# Altium schematic sheet 1_P1.schdoc
size 431 x 309 mm; Symbol: sheet-symbol_a4; Device: Sheet-Symbol_A4; Company: 嘉立创EDA; Version: V1.0; Page Size: A4; @Project Name: STM32F407保险方案; @Page Count: 2; @Update Date: 2024-10-13; @Create Date: 2024-10-12; @Schematic Name: Schematic1_2; @Page No: 1; @Page Name: P1; @Board Name: Board1_v1_修改; @Create Time: 12:06:10; @Update Time: 12:06:11; Width: 1655; Height: 1170; Region Start: 1; X Region Count: 6; Y Region Count: 4; Blade Width: 10; Title Block Position: 3
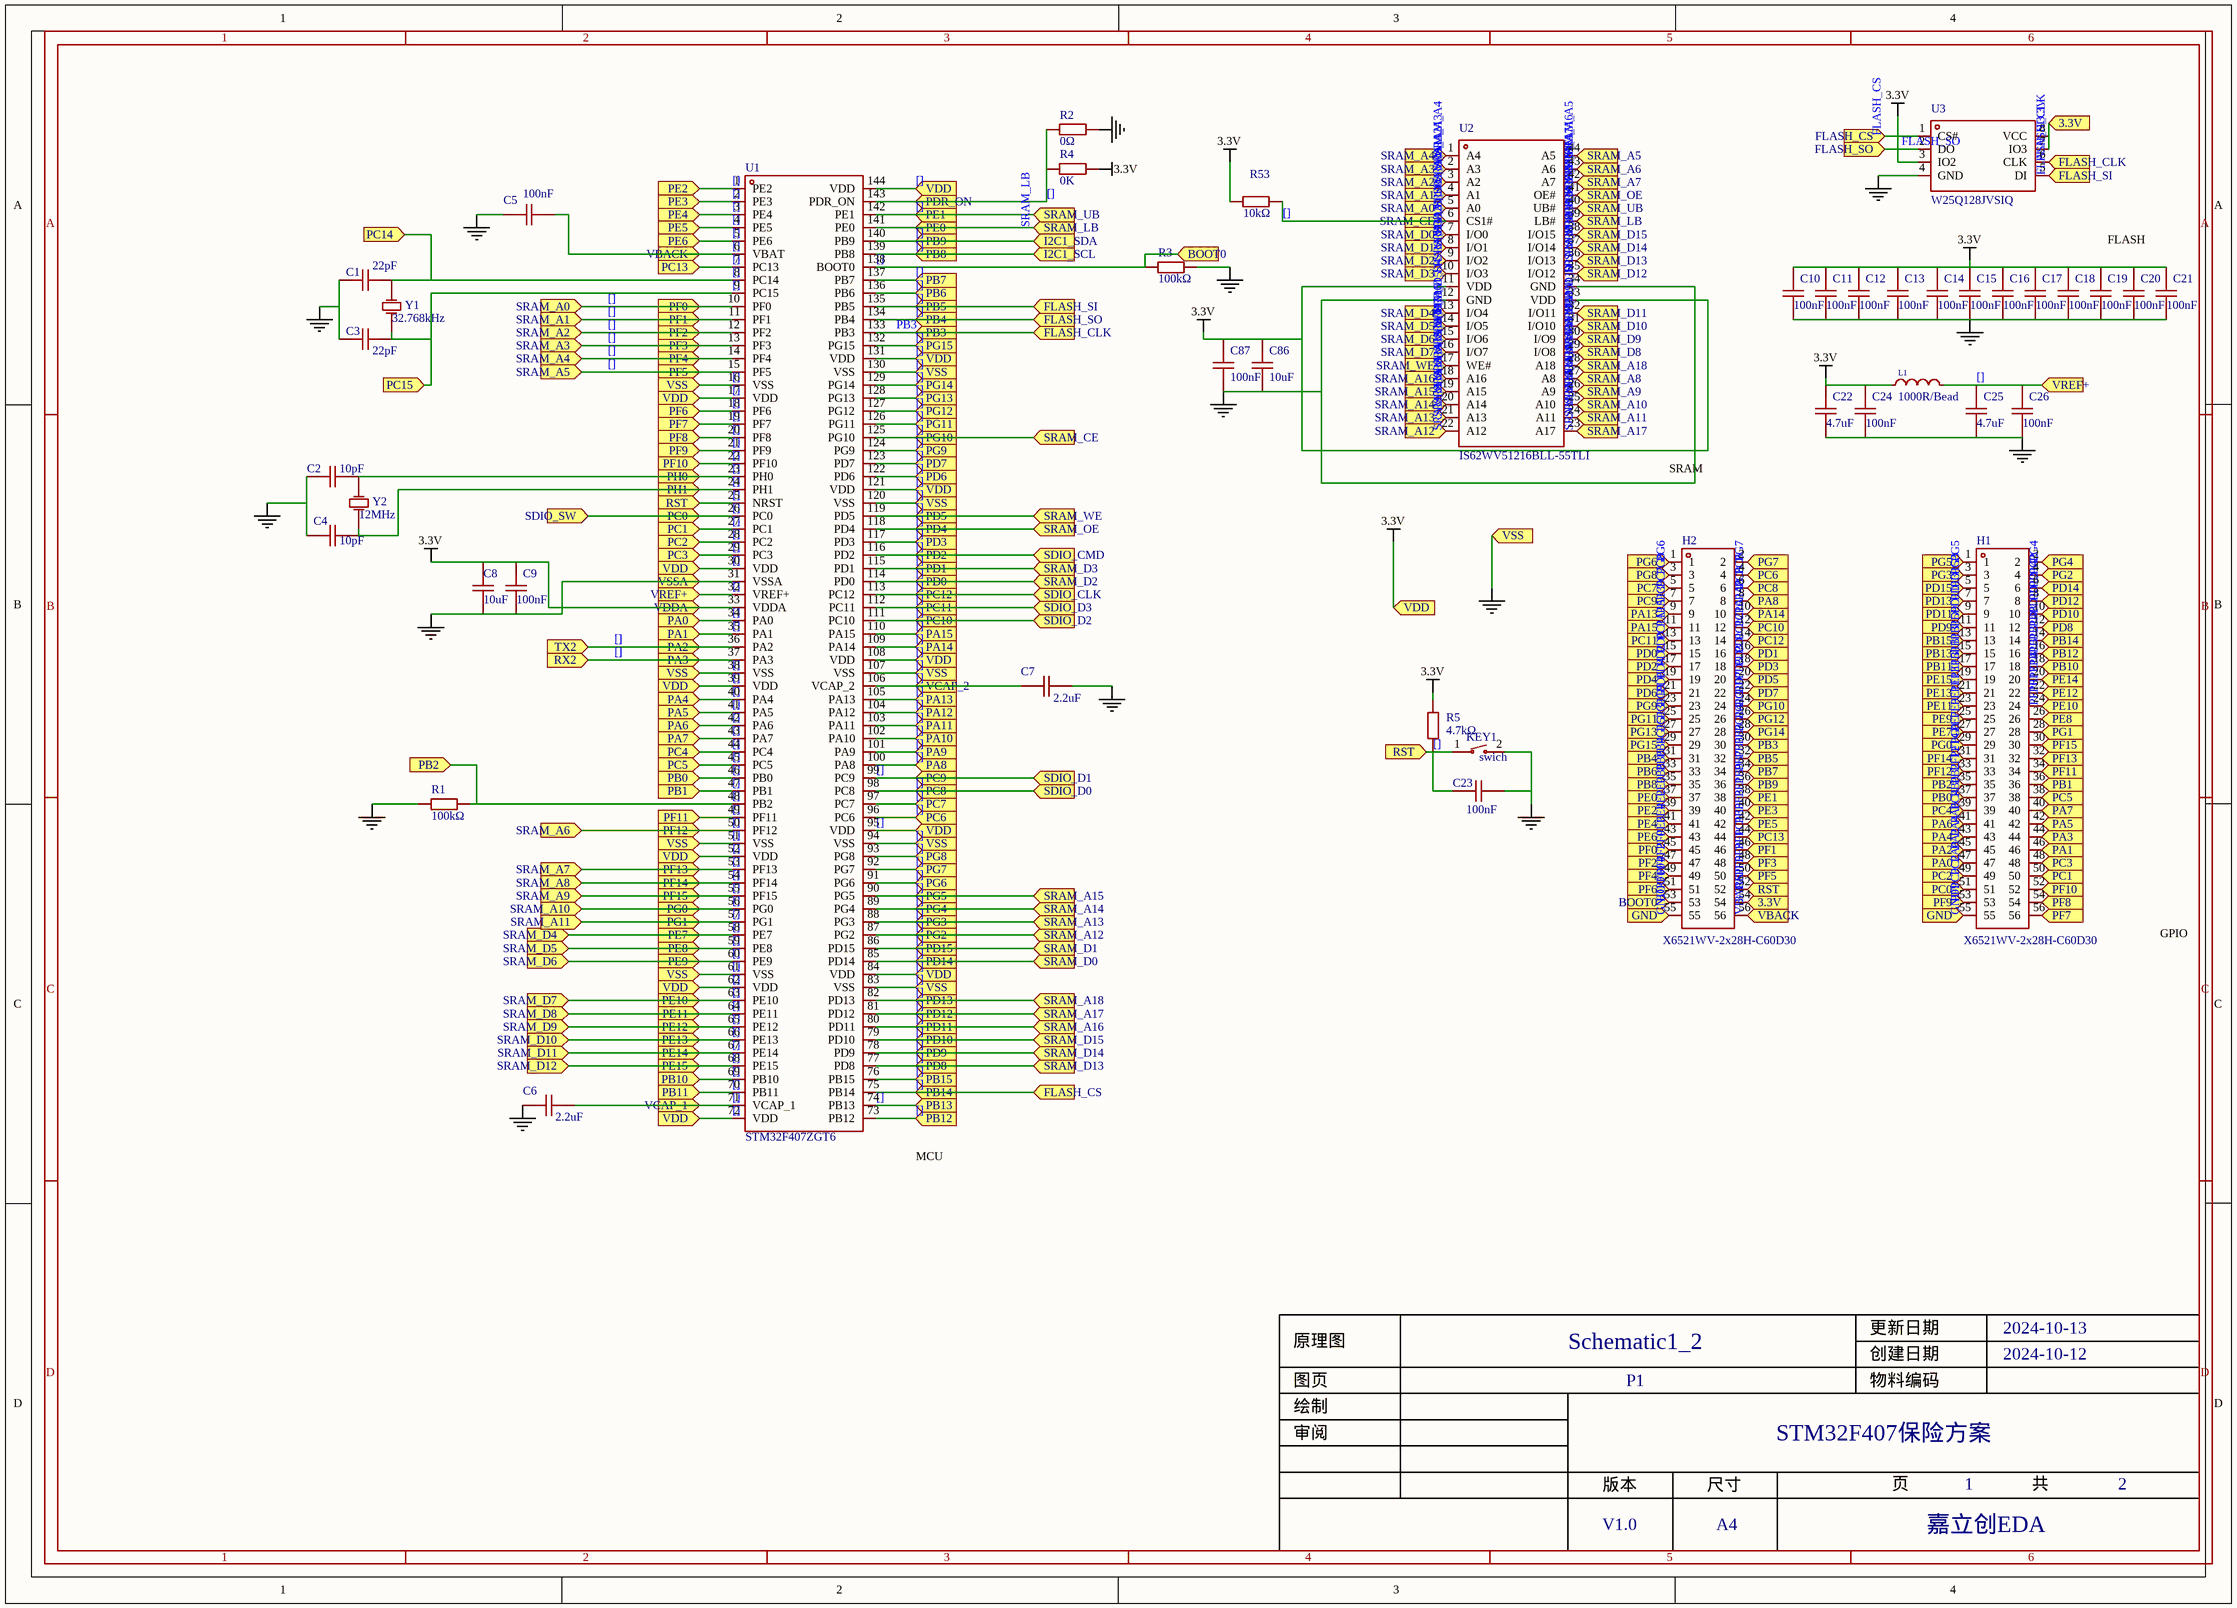
[diagram p0: 1_P1.schdoc]

## Parts
C1  22pF  [C0805]  (value not drawn)
C2  10pF  [C0805]  (value not drawn)
C3  22pF  [C0805]  (value not drawn)
C4  10pF  [C0805]  (value not drawn)
C5  100nF  [C0805]  (value not drawn)
C6  2.2uF  [C0805]  (value not drawn)
C7  2.2uF  [C0805]  (value not drawn)
C8  10uF  [C0805]  (value not drawn)
C9  100nF  [C0805]  (value not drawn)
C10  100nF  [C0805]  (value not drawn)
C11  100nF  [C0805]  (value not drawn)
C12  100nF  [C0805]  (value not drawn)
C13  100nF  [C0805]  (value not drawn)
C14  100nF  [C0805]  (value not drawn)
C15  100nF  [C0805]  (value not drawn)
C16  100nF  [C0805]  (value not drawn)
C17  100nF  [C0805]  (value not drawn)
C18  100nF  [C0805]  (value not drawn)
C19  100nF  [C0805]  (value not drawn)
C20  100nF  [C0805]  (value not drawn)
C21  100nF  [C0805]  (value not drawn)
C22  4.7uF  [C0805]  (value not drawn)
C23  100nF  [C0805]  (value not drawn)
C24  100nF  [C0805]  (value not drawn)
C25  4.7uF  [C0805]  (value not drawn)
C26  100nF  [C0805]  (value not drawn)
C86  10uF  [C0805]  (value not drawn)
C87  100nF  [C0805]  (value not drawn)
H1  X6521WV-2x28H-C60D30  [HDR-TH_56P-2.54-V-M-R2-C28-S2.54]  (value not drawn)
H2  X6521WV-2x28H-C60D30  [HDR-TH_56P-2.54-V-M-R2-C28-S2.54]  (value not drawn)
KEY1  swich  [KEY-SMD_L6.0-W3.6-LS8.0]  (value not drawn)
L1  1000R/Bead  [L0805]  (value not drawn)
R1  100kΩ  [R0805]  (value not drawn)
R2  0Ω  [R0805]  (value not drawn)
R3  100kΩ  [R0805]  (value not drawn)
R4  0K  [R0805]  (value not drawn)
R5  4.7kΩ  [R0805]  (value not drawn)
R53  10kΩ  [R0805]  (value not drawn)
U1  STM32F407ZGT6  [LQFP-144_L20.0-W20.0-P0.50-LS22.0-BL]  (value not drawn)
U2  IS62WV51216BLL-55TLI  [TSOP-44_L18.4-W10.2-P0.80-LS11.8-BL]  (value not drawn)
U3  W25Q128JVSIQ  [SOIC-8_L5.3-W5.3-P1.27-LS8.0-BL]  (value not drawn)
Y1  32.768kHz  [OSC-TH_BD3.1-P0.8-D0.3]  (value not drawn)
Y2  12MHz  [HC-49US_L11.5-W4.5-P4.88]  (value not drawn)

## Ports
3.3V (in), BOOT0 (in), FLASH_CLK (in), FLASH_CS (in), FLASH_SI (in), FLASH_SO (in), GND (in), I2C1_SCL (in), I2C1_SDA (in), PA0 (in), PA1 (in), PA2 (in), PA3 (in), PA4 (in), PA5 (in), PA6 (in), PA7 (in), PA8 (in), PA9 (in), PA10 (in), PA11 (in), PA12 (in), PA13 (in), PA14 (in), PA15 (in), PB0 (in), PB1 (in), PB2 (in), PB3 (in), PB4 (in), PB5 (in), PB6 (in), PB7 (in), PB8 (in), PB9 (in), PB10 (in), PB11 (in), PB12 (in), PB13 (in), PB14 (in), PB15 (in), PC0 (in), PC1 (in), PC2 (in), PC3 (in), PC4 (in), PC5 (in), PC6 (in), PC7 (in), PC8 (in), PC9 (in), PC10 (in), PC11 (in), PC12 (in), PC13 (in), PC14 (in), PC15 (in), PD0 (in), PD1 (in), PD2 (in), PD3 (in), PD4 (in), PD5 (in), PD6 (in), PD7 (in), PD8 (in), PD9 (in), PD10 (in), PD11 (in), PD12 (in), PD13 (in), PD14 (in), PD15 (in), PDR_ON (in), PE0 (in), PE1 (in), PE2 (in), PE3 (in), PE4 (in), PE5 (in), PE6 (in), PE7 (in), PE8 (in), PE9 (in), PE10 (in), PE11 (in), PE12 (in), PE13 (in), PE14 (in), PE15 (in), PF0 (in), PF1 (in), PF2 (in), PF3 (in), PF4 (in), PF5 (in), PF6 (in), PF7 (in), PF8 (in), PF9 (in), PF10 (in), PF11 (in), PF12 (in), PF13 (in), PF14 (in), PF15 (in), PG0 (in), PG1 (in), PG2 (in), PG3 (in), PG4 (in), PG5 (in), PG6 (in), PG7 (in), PG8 (in), PG9 (in), PG10 (in), PG11 (in), PG12 (in), PG13 (in), PG14 (in), PG15 (in), PH0 (in), PH1 (in), RST (in), RX2 (in), SDIO_CLK (in), SDIO_CMD (in), SDIO_D0 (in), SDIO_D1 (in), SDIO_D2 (in), SDIO_D3 (in), SDIO_SW (in), SRAM_A0 (in), SRAM_A1 (in), SRAM_A2 (in), SRAM_A3 (in), SRAM_A4 (in), SRAM_A5 (in), SRAM_A6 (in), SRAM_A7 (in), SRAM_A8 (in), SRAM_A9 (in), SRAM_A10 (in), SRAM_A11 (in), SRAM_A12 (in), SRAM_A13 (in), SRAM_A14 (in), SRAM_A15 (in), SRAM_A16 (in), SRAM_A17 (in), SRAM_A18 (in), SRAM_CE (in), SRAM_D0 (in), SRAM_D1 (in), SRAM_D2 (in), SRAM_D3 (in), SRAM_D4 (in), SRAM_D5 (in), SRAM_D6 (in), SRAM_D7 (in), SRAM_D8 (in), SRAM_D9 (in), SRAM_D10 (in), SRAM_D11 (in), SRAM_D12 (in), SRAM_D13 (in), SRAM_D14 (in), SRAM_D15 (in), SRAM_LB (in), SRAM_OE (in), SRAM_UB (in), SRAM_WE (in), TX2 (in), VBACK (in), VCAP_1 (in), VCAP_2 (in), VDD (in), VDDA (in), VREF+ (in), VSS (in), VSSA (in)

## Nets
3.3V: C1.2 C2.2 C3.2 C4.2 C5.1 C6.1 C7.2 C8.1 C9.1 C10.2 C11.2 C12.2 C13.2 C14.2 C15.2 C16.2 C17.2 C18.2 C19.2 C20.2 C21.2 C22.2 C23.2 C24.2 C25.2 C26.2 C86.1 C87.1 H1.1 H1.2 H1.3 H1.4 H1.5 H1.6 H1.7 H1.8 H1.9 H1.10 H1.11 H1.12 H1.13 H1.14 H1.15 H1.16 H1.17 H1.18 H1.19 H1.20 H1.21 H1.22 H1.23 H1.24 H1.25 H1.26 H1.27 H1.28 H1.29 H1.30 H1.31 H1.32 H1.33 H1.34 H1.35 H1.36 H1.37 H1.38 H1.39 H1.40 H1.41 H1.42 H1.43 H1.44 H1.45 H1.46 H1.47 H1.48 H1.49 H1.50 H1.51 H1.52 H1.53 H1.54 H1.56 H2.1 H2.2 H2.3 H2.4 H2.5 H2.6 H2.7 H2.8 H2.9 H2.10 H2.11 H2.12 H2.13 H2.14 H2.15 H2.16 H2.17 H2.18 H2.19 H2.20 H2.21 H2.22 H2.23 H2.24 H2.25 H2.26 H2.27 H2.28 H2.29 H2.31 H2.32 H2.33 H2.34 H2.35 H2.36 H2.38 H2.39 H2.40 H2.41 H2.42 H2.43 H2.44 H2.45 H2.46 H2.47 H2.48 H2.49 H2.50 H2.51 H2.52 H2.53 H2.54 H2.56 KEY1.1 L1.1 L1.2 R1.1 R2.1 R3.1 R4.1 R4.2 R5.1 R5.2 R53.1 R53.2 U1.1(PE2) U1.2(PE3) U1.3(PE4) U1.4(PE5) U1.5(PE6) U1.6(VBAT) U1.7(PC13) U1.8(PC14) U1.9(PC15) U1.10(PF0) U1.11(PF1) U1.12(PF2) U1.13(PF3) U1.14(PF4) U1.15(PF5) U1.16(VSS) U1.17(VDD) U1.18(PF6) U1.19(PF7) U1.20(PF8) U1.21(PF9) U1.22(PF10) U1.23(PH0) U1.24(PH1) U1.25(NRST) U1.26(PC0) U1.27(PC1) U1.28(PC2) U1.29(PC3) U1.30(VDD) U1.32(VREF+) U1.33(VDDA) U1.34(PA0) U1.35(PA1) U1.36(PA2) U1.37(PA3) U1.38(VSS) U1.39(VDD) U1.40(PA4) U1.41(PA5) U1.42(PA6) U1.43(PA7) U1.44(PC4) U1.45(PC5) U1.46(PB0) U1.47(PB1) U1.48(PB2) U1.49(PF11) U1.50(PF12) U1.51(VSS) U1.52(VDD) U1.53(PF13) U1.54(PF14) U1.55(PF15) U1.56(PG0) U1.57(PG1) U1.58(PE7) U1.59(PE8) U1.60(PE9) U1.61(VSS) U1.62(VDD) U1.63(PE10) U1.64(PE11) U1.65(PE12) U1.66(PE13) U1.67(PE14) U1.68(PE15) U1.69(PB10) U1.70(PB11) U1.71(VCAP_1) U1.72(VDD) U1.73(PB12) U1.74(PB13) U1.75(PB14) U1.76(PB15) U1.77(PD8) U1.78(PD9) U1.79(PD10) U1.80(PD11) U1.81(PD12) U1.82(PD13) U1.83(VSS) U1.84(VDD) U1.85(PD14) U1.86(PD15) U1.87(PG2) U1.88(PG3) U1.89(PG4) U1.90(PG5) U1.91(PG6) U1.92(PG7) U1.93(PG8) U1.94(VSS) U1.95(VDD) U1.96(PC6) U1.97(PC7) U1.98(PC8) U1.99(PC9) U1.100(PA8) U1.101(PA9) U1.102(PA10) U1.103(PA11) U1.104(PA12) U1.105(PA13) U1.106(VCAP_2) U1.107(VSS) U1.108(VDD) U1.109(PA14) U1.110(PA15) U1.111(PC10) U1.112(PC11) U1.113(PC12) U1.114(PD0) U1.115(PD1) U1.116(PD2) U1.117(PD3) U1.118(PD4) U1.119(PD5) U1.120(VSS) U1.121(VDD) U1.122(PD6) U1.123(PD7) U1.124(PG9) U1.125(PG10) U1.126(PG11) U1.127(PG12) U1.128(PG13) U1.129(PG14) U1.130(VSS) U1.131(VDD) U1.132(PG15) U1.134(PB4) U1.135(PB5) U1.136(PB6) U1.137(PB7) U1.138(BOOT0) U1.139(PB8) U1.140(PB9) U1.142(PE1) U1.143(PDR_ON) U1.144(VDD) U2.1(A4) U2.2(A3) U2.3(A2) U2.4(A1) U2.5(A0) U2.6(CS1#) U2.7(I/O0) U2.8(I/O1) U2.9(I/O2) U2.10(I/O3) U2.11(VDD) U2.13(I/O4) U2.14(I/O5) U2.15(I/O6) U2.16(I/O7) U2.17(WE#) U2.18(A16) U2.19(A15) U2.20(A14) U2.21(A13) U2.22(A12) U2.23(A17) U2.24(A11) U2.25(A10) U2.26(A9) U2.27(A8) U2.28(A18) U2.29(I/O8) U2.30(I/O9) U2.31(I/O10) U2.32(I/O11) U2.33(VDD) U2.35(I/O12) U2.36(I/O13) U2.37(I/O14) U2.38(I/O15) U2.40(UB#) U2.41(OE#) U2.42(A7) U2.43(A6) U2.44(A5) U3.1(CS#) U3.2(DO) U3.3(IO2) U3.5(DI) U3.7(IO3) U3.8(VCC) Y1.1(OSC1) Y1.2(OSC2) Y2.1(OSC1) Y2.2(OSC2) ; port VSS, port SRAM_A4, port SRAM_A3, port SRAM_A2, port SRAM_A1, port SRAM_A0, port SRAM_CE, port SRAM_D0, port SRAM_D1, port SRAM_D2, port SRAM_D3, port SRAM_D4, port SRAM_D5, port SRAM_D6, port SRAM_D7, port SRAM_WE, port SRAM_A16, port SRAM_A15, port SRAM_A14, port SRAM_A13, port SRAM_A12, port SRAM_A17, port SRAM_A11, port SRAM_A10, port SRAM_A9, port SRAM_A8, port SRAM_A18, port SRAM_D8, port SRAM_D9, port SRAM_D10, port SRAM_D11, port SRAM_D12, port SRAM_D13, port SRAM_D14, port SRAM_D15, port SRAM_UB, port SRAM_OE, port SRAM_A7, port SRAM_A6, port SRAM_A5, port FLASH_CS, port FLASH_SO, port 3.3V, port FLASH_SI, port VREF+, port RST, port PE1, port PDR_ON, port VDD, port PE4, port PE5, port PE6, port PE2, port PE3, port VBACK, port PC13, port PF3, port PF4, port PC15, port PF0, port PF1, port PF2, port PF5, port PC14, port PB1, port PB2, port PE8, port PE9, port PE10, port PE11, port PE12, port PE13, port PE14, port PE15, port PB14, port PB15, port PD8, port PD9, port PD10, port PD11, port PD12, port PD13, port VCAP_1, port PB12, port PB13, port PB10, port PB11, port PF6, port PF7, port PF8, port PF9, port PF10, port PH0, port PH1, port PC0, port PC1, port PC2, port PC3, port VDDA, port PA0, port PA1, port PA2, port PA3, port PA4, port PA5, port PA6, port PA7, port PC4, port PC5, port PB0, port PF11, port PF12, port PF13, port PF14, port PF15, port PG0, port PG1, port PE7, port PB5, port PB6, port PB7, port BOOT0, port PB8, port PB9, port PG3, port PG4, port PG5, port PD14, port PD15, port PG2, port PG6, port PG7, port PG8, port PC6, port PC7, port PG9, port PG10, port PG11, port PG12, port PG13, port PG14, port PG15, port PB4, port PC10, port PC11, port PC12, port PD0, port PD1, port PD2, port PD3, port PD4, port PD5, port PD6, port PD7, port PA14, port PA15, port VCAP_2, port PA8, port PA9, port PA10, port PA11, port PA12, port PA13, port PC8, port PC9, port TX2, port RX2, port I2C1_SCL, port I2C1_SDA, port SDIO_SW, port SDIO_D0, port SDIO_D1, port SDIO_D2, port SDIO_D3, port SDIO_CLK, port SDIO_CMD  [also labelled [], BOOT0, FLASH_CS, FLASH_SI, FLASH_SO, PA0, PA13, PA14, PA15, PA2, PA4, PA6, PA8, PB0, PB10, PB11, PB12, PB13, PB14, PB15, PB2, PB4, PB5, PB6, PB7, PB8, PB9, PC0, PC10, PC11, PC12, PC13, PC2, PC4, PC6, PC7, PC8, PC9, PD0, PD1, PD10, PD11, PD12, PD13, PD14, PD15, PD2, PD3, PD4, PD5, PD6, PD7, PD8, PD9, PE1, PE10, PE11, PE12, PE13, PE14, PE15, PE2, PE3, PE4, PE5, PE6, PE7, PE9, PF0, PF1, PF12, PF14, PF2, PF3, PF4, PF5, PF6, PF9, PG0, PG10, PG11, PG12, PG13, PG14, PG15, PG2, PG3, PG4, PG5, PG6, PG7, PG8, PG9, RST, SRAM_A0, SRAM_A1, SRAM_A10, SRAM_A11, SRAM_A12, SRAM_A13, SRAM_A14, SRAM_A15, SRAM_A16, SRAM_A17, SRAM_A18, SRAM_A2, SRAM_A3, SRAM_A4, SRAM_A5, SRAM_A6, SRAM_A7, SRAM_A8, SRAM_A9, SRAM_D0, SRAM_D1, SRAM_D10, SRAM_D11, SRAM_D12, SRAM_D13, SRAM_D14, SRAM_D15, SRAM_D2, SRAM_D3, SRAM_D4, SRAM_D5, SRAM_D6, SRAM_D7, SRAM_D8, SRAM_D9, SRAM_OE, SRAM_UB, SRAM_WE, VBACK, VSS]
GND: C1.1 C2.1 C3.1 C4.1 C5.2 C6.2 C7.1 C8.2 C9.2 C10.1 C11.1 C12.1 C13.1 C14.1 C15.1 C16.1 C17.1 C18.1 C19.1 C20.1 C21.1 C22.1 C23.1 C24.1 C25.1 C26.1 C86.2 C87.2 H1.55 H2.55 KEY1.2 R1.2 R2.2 R3.2 U1.31(VSSA) U2.12(GND) U2.34(GND) U3.4(GND) ; port VSSA, port GND
FLASH_CLK: H2.30 U1.133(PB3) U3.6(CLK) ; port FLASH_CLK, port PB3  [also labelled PB3]
PE0: H2.37 U1.141(PE0) U2.39(LB#) ; port SRAM_LB, port PE0  [also labelled SRAM_LB]

## Notes on the sheet
- FLASH
- SRAM
- GPIO
- MCU
- 1
- 2
- 3
- 4
- 5
- 6
- A
- B
- C
- D
- 原理图
- Schematic1_2
- 创建日期
- 更新日期
- 2024-10-13
- 2024-10-12
- 审阅
- 绘制
- 图页
- P1
- 物料编码
- STM32F407保险方案
- 版本
- 尺寸
- 页
- 共
- V1.0
- A4
- 嘉立创EDA

## Library data of the parts
C1 C3 = CC0805JRNPO9BN220: 容值:22pF;精度:±5%;额定电压:50V;材质(温度系数):NP0;; Manufacturer: YAGEO(国巨); Symbol: CapAcitance; Add into BOM: yes; Tolerance: ±5%; Voltage Rated: 50V; Temperature Coefficient: NP0; Device: CC0805JRNPO9BN220; LCSC Part Name: 22pF ±5% 50V; Supplier Part: C105623; Manufacturer Part: CC0805JRNPO9BN220; Supplier Footprint: 0805; JLCPCB Part Class: Extended Part; Datasheet: https://atta.szlcsc.com/upload/public/pdf/source/20170505/1493957838062.pdf; Supplier: LCSC; Convert to PCB: yes; Value: 22pF
C2 C4 = CC0805JRNPO9BN100: 容值:10pF;精度:±5%;额定电压:50V;材质(温度系数):NP0;; Manufacturer: YAGEO(国巨); Symbol: CapAcitance; Add into BOM: yes; Tolerance: ±5%; Voltage Rated: 50V; Temperature Coefficient: NP0; Device: CC0805JRNPO9BN100; LCSC Part Name: 10pF ±5% 50V; Supplier Part: C107107; Manufacturer Part: CC0805JRNPO9BN100; Supplier Footprint: 0805; JLCPCB Part Class: Extended Part; Datasheet: https://atta.szlcsc.com/upload/public/pdf/source/20231121/E6B7358C10879AC104478A67BFFD3D0E.pdf; Supplier: LCSC; Convert to PCB: yes; Value: 10pF
C5 C9-C21 C23 C24 C26 C87 = CC0805KRX7R9BB104: 容值:100nF;精度:±10%;额定电压:50V;材质(温度系数):X7R;; Manufacturer: YAGEO(国巨); Symbol: CapAcitance; Add into BOM: yes; Tolerance: ±10%; Voltage Rated: 50V; Temperature Coefficient: X7R; Device: CC0805KRX7R9BB104; LCSC Part Name: 100nF ±10% 50V; Supplier Part: C49678; Manufacturer Part: CC0805KRX7R9BB104; Supplier Footprint: 0805; JLCPCB Part Class: Basic Part; Datasheet: https://atta.szlcsc.com/upload/public/pdf/source/20180224/C181747_15194369449651363981.pdf; Supplier: LCSC; Convert to PCB: yes; Value: 100nF
C6 C7 = CC0805KKX7R9BB225: 容值:2.2uF;精度:±10%;额定电压:50V;材质(温度系数):X7R;; Manufacturer: YAGEO(国巨); Symbol: CapAcitance; Add into BOM: yes; Tolerance: ±10%; Voltage Rated: 50V; Temperature Coefficient: X7R; Device: CC0805KKX7R9BB225; LCSC Part Name: 2.2uF ±10% 50V; Supplier Part: C125847; Manufacturer Part: CC0805KKX7R9BB225; Supplier Footprint: 0805; JLCPCB Part Class: Extended Part; Datasheet: https://atta.szlcsc.com/upload/public/pdf/source/20181008/C309510_22F155564471FAF6A489F7D68F34234E.pdf; Supplier: LCSC; Convert to PCB: yes; Value: 2.2uF
C8 = CC0805KKX5R8BB106_C89831: 容值:10uF;精度:±10%;额定电压:25V;材质(温度系数):X5R;; Manufacturer: YAGEO(国巨); Symbol: CapAcitance; Add into BOM: yes; Tolerance: ±10%; Voltage Rated: 25V; Temperature Coefficient: X5R; Device: CC0805KKX5R8BB106_C89831; LCSC Part Name: 10uF ±10% 25V; Supplier Part: C89831; Manufacturer Part: CC0805KKX5R8BB106; Supplier Footprint: 0805; JLCPCB Part Class: Extended Part; Datasheet: https://atta.szlcsc.com/upload/public/pdf/source/20180403/C190190_A1AA8A0854FDD509EBDBDAD022A1C1DB.pdf; Supplier: LCSC; Convert to PCB: yes; Value: 10uF
C22 C25 = CL21A475KAQNNNE: 容值:4.7uF;精度:±10%;额定电压:25V;材质(温度系数):X5R;; Manufacturer: SAMSUNG(三星); Symbol: CapAcitance; Add into BOM: yes; Tolerance: ±10%; Voltage Rated: 25V; Temperature Coefficient: X5R; Device: CL21A475KAQNNNE; LCSC Part Name: 4.7uF ±10% 25V; Supplier Part: C1779; Manufacturer Part: CL21A475KAQNNNE; Supplier Footprint: 0805; JLCPCB Part Class: Basic Part; Datasheet: https://atta.szlcsc.com/upload/public/pdf/source/20160218/1457707763339.pdf; Supplier: LCSC; Convert to PCB: yes; Value: 4.7uF
C86 = CL21A106KAYNNNE_C15850: 容值:10uF;精度:±10%;额定电压:25V;材质(温度系数):X5R;; Manufacturer: SAMSUNG(三星); Symbol: CapAcitance; Add into BOM: yes; Tolerance: ±10%; Voltage Rated: 25V; Temperature Coefficient: X5R; Device: CL21A106KAYNNNE_C15850; LCSC Part Name: 10uF ±10% 25V; Supplier Part: C15850; Manufacturer Part: CL21A106KAYNNNE; Supplier Footprint: 0805; JLCPCB Part Class: Basic Part; Datasheet: https://atta.szlcsc.com/upload/public/pdf/source/20160218/1457707763339.pdf; Supplier: LCSC; Convert to PCB: yes; Value: 10uF
H1 H2 = X6521WV-2x28H-C60D30: 插针结构:2x28P;间距:2.54mm;行距:2.54mm;圆针/方针:方针;安装类型:-;排数:双排;总PIN位数:56P;额定电流:3A;额定电压:250V;配合针长度:-;塑高:2.5mm;端接针长度:-;触头材质:黄铜;触头镀层:金;工作温度范围:-40℃~+105℃;焊接温度(最大值):260℃;颜色:黑色;; Manufacturer: XKB Connection(中国星坤); Symbol: X6521WV-2×28H-C30D60; Add into BOM: yes; Pin Structure: 2x28P; Pitch: 2.54mm; Circluar Pins/Square Pins: 方针; Current Rating (Max): 3A; Voltage Rating (Max): 250V; Soldering Temperature(Max): 260℃; Device: X6521WV-2x28H-C60D30; LCSC Part Name: 2x28P 间距:2.54mm 方针; Supplier Part: C725900; Manufacturer Part: X6521WV-2x28H-C60D30; Supplier Footprint: 插件,P=2.54mm; JLCPCB Part Class: 扩展库; Supplier: LCSC; Convert to PCB: yes; Row Spacing: 2.54mm; Mounting Type: -; Number of Rows: 双排; Number of Pins: 56P; Length of Mating Pin: -; Insulation Height: 2.5mm; Length of End Connection Pin: -; Contact Material: 黄铜; Contact Plating: 金; Operating Temperature Range: -40℃~+105℃; Color: 黑色
KEY1 = UK-B0240-R-250-JZ: 电路结构:单刀单掷;按钮形状:矩形按钮;作用力:250gf;安装方式:立贴;开关长度:6mm;开关宽度:3.6mm;开关高度:2.5mm;带支架:不带;触点电流:50mA;额定电压(DC):12V;绝缘电阻:100MΩ;带灯:无;机械寿命:10万次;; Manufacturer: USAKRO(美韩); Add into BOM: yes; Circuit: 单刀单掷; Actuator Style: 矩形按钮; Operating Force: 250gf; Switch Length: 6mm; Switch Width: 3.6mm; Switch Height: 2.5mm; Strike Gundam: 不带; Contact Current: 50mA; Voltage Rating (DC): 12V; Insulation Resistance: 100MΩ; Actuator/Cap Color: 红色; With Lamp: 无; Pin Style: 鸥翼型; Mechanical Life: 10万次; Symbol: UK-B0240-R-250-JZ; Device: UK-B0240-R-250-JZ; Supplier: LCSC; Supplier Part: C698192; Manufacturer Part: swich; JLCPCB Part Class: Extended Part; LCSC Part Name: 6*3.6*2.5mm 立贴 轻触开关; Supplier Footprint: SMD; Datasheet: https://atta.szlcsc.com/upload/public/pdf/source/20200708/C698192_4C83FD1DB5EA5644F9F247945444D54B.pdf; Convert to PCB: yes; Mounting Style: 立贴; Operating Temperature: -20℃~+70℃; Voltage Rating (AC): -; Power Rating: -; IP Rating: -
L1 = ABPY00201209102Y00_C2847077: 标称阻抗@测试频率:1kΩ@100MHz;直流电阻(RDC):120mΩ;; Manufacturer: chilisin(奇力新); Add into BOM: yes; DC Resistance: 120mΩ; Circuits: 1; Symbol: ABPY00201209102Y00_C2847077; Device: ABPY00201209102Y00_C2847077; Supplier: LCSC; Supplier Part: C2847077; Manufacturer Part: 1000R/Bead; LCSC Part Name: Bead 2012 1000Ω 1500mA 车规; Supplier Footprint: 0805; Datasheet: https://atta.szlcsc.com/upload/public/pdf/source/20221101/306FD9D16D2888E3DBE7E302D6493501.pdf; Convert to PCB: yes; Impedance @ Frequency: 1kΩ@100MHz
R1 R3 = 0805W8F1003T5E: 电阻类型:厚膜电阻;阻值:100kΩ;精度:±1%;功率:125mW;最大工作电压:150V;温度系数:±100ppm/℃;; Manufacturer: UNI-ROYAL(厚声); Symbol: 电阻; Add into BOM: yes; Tolerance: ±1%; Power(Watts): 125mW; Overload Voltage (Max): 150V; Device: 0805W8F1003T5E; LCSC Part Name: 100kΩ ±1% 125mW 厚膜电阻; Supplier Part: C149504; Manufacturer Part: 0805W8F1003T5E; Supplier Footprint: 0805; JLCPCB Part Class: Basic Part; Datasheet: https://atta.szlcsc.com/upload/public/pdf/source/20200306/C422600_1E6D84923E4A46A82E41ADD87F860B5C.pdf; Supplier: LCSC; Convert to PCB: yes; Type: 厚膜电阻; Value: 100kΩ; Temperature Coefficient: ±100ppm/℃; Operating Temperature Range: -55℃~+155℃
R2 = 0805W8F0000T5E: 电阻类型:厚膜电阻;阻值:0Ω;精度:±1%;功率:125mW;最大工作电压:150V;温度系数:±800ppm/℃;; Manufacturer: UNI-ROYAL(厚声); Symbol: 电阻; Add into BOM: yes; Tolerance: ±1%; Power(Watts): 125mW; Overload Voltage (Max): 150V; Device: 0805W8F0000T5E; LCSC Part Name: 0Ω ±1% 125mW 厚膜电阻; Supplier Part: C17477; Manufacturer Part: 0805W8F0000T5E; Supplier Footprint: 0805; JLCPCB Part Class: Basic Part; Datasheet: https://atta.szlcsc.com/upload/public/pdf/source/20200306/C422600_1E6D84923E4A46A82E41ADD87F860B5C.pdf; Supplier: LCSC; Convert to PCB: yes; Type: 厚膜电阻; Value: 0Ω; Temperature Coefficient: ±800ppm/℃; Operating Temperature Range: -55℃~+155℃
R4 = Res_0603: Symbol: 电阻; Convert to PCB: yes; Device: Res_0603; Add into BOM: yes; Supplier Footprint: 0603; Value: 0K
R5 = 0805W8F4701T5E: 电阻类型:厚膜电阻;阻值:4.7kΩ;精度:±1%;功率:125mW;最大工作电压:150V;温度系数:±100ppm/℃;; Manufacturer: UNI-ROYAL(厚声); Symbol: 电阻; Add into BOM: yes; Tolerance: ±1%; Power(Watts): 125mW; Overload Voltage (Max): 150V; Device: 0805W8F4701T5E; LCSC Part Name: 4.7kΩ ±1% 125mW 厚膜电阻; Supplier Part: C17673; Manufacturer Part: 0805W8F4701T5E; Supplier Footprint: 0805; JLCPCB Part Class: Basic Part; Datasheet: https://atta.szlcsc.com/upload/public/pdf/source/20200306/C422600_1E6D84923E4A46A82E41ADD87F860B5C.pdf; Supplier: LCSC; Convert to PCB: yes; Type: 厚膜电阻; Value: 4.7kΩ; Temperature Coefficient: ±100ppm/℃; Operating Temperature Range: -55℃~+155℃
R53 = 0805W8F1002T5E_C17414: 电阻类型:厚膜电阻;阻值:10kΩ;精度:±1%;功率:125mW;最大工作电压:150V;温度系数:±100ppm/℃;; Manufacturer: UNI-ROYAL(厚声); Symbol: 电阻; Add into BOM: yes; Tolerance: ±1%; Power(Watts): 125mW; Overload Voltage (Max): 150V; Device: 0805W8F1002T5E_C17414; LCSC Part Name: 10kΩ ±1% 125mW 厚膜电阻; Supplier Part: C17414; Manufacturer Part: 0805W8F1002T5E; Supplier Footprint: 0805; JLCPCB Part Class: Basic Part; Datasheet: https://atta.szlcsc.com/upload/public/pdf/source/20200306/C422600_1E6D84923E4A46A82E41ADD87F860B5C.pdf; Supplier: LCSC; Convert to PCB: yes; Type: 厚膜电阻; Value: 10kΩ; Temperature Coefficient: ±100ppm/℃; Operating Temperature Range: -55℃~+155℃
U1 = STM32F407ZGT6: CPU内核:ARM-M4;程序存储容量:1MB;RAM总容量:192KB;GPIO端口数量:114;工作电压范围:1.8V~3.6V;CPU最大主频:168MHz;程序存储器类型:FLASH;; Manufacturer: ST(意法半导体); Add into BOM: yes; CPU Core: ARM-M4; Program Storage Size: 1MB; RAM Size: 192KB; GPIO Ports Number: 114; CPU Maximum Speed: 168MHz; Program Memory Type: FLASH; ADC (Bit): 12bit; Universal Serial Bus: 有; Peripheral/Function: DMA；LCD/LED驱动; Symbol: STM32F407ZGT6; Device: STM32F407ZGT6; LCSC Part Name: 带DSP和FPU的高性能基础系列ARM Cortex-M4 MCU，具有1 MB Flash、168 MHz CPU、ART加速器、以太网和FSMC; Supplier Part: C19156; Manufacturer Part: STM32F407ZGT6; Supplier Footprint: LQFP-144(20x20); JLCPCB Part Class: 扩展库; Datasheet: https://atta.szlcsc.com/upload/public/pdf/source/20140801/1457707197138.pdf; Supplier: LCSC; Convert to PCB: yes; Operating Voltage Range: 1.8V~3.6V; Operating Temperature Range: -40℃~+85℃; DAC (Bit): 12bit; PWM (Bit): -; Internal Comparator: -; communication protocol: -; Watchdog: 有; Real-Time Clock: -; Infrared Data Association: 有; Low-Voltage Detect: 有; CCP Capture/Compare: -; LCD Module: 有; Secure Digital Input and Output: -; Direct Memory Access: 有; Internal Oscillator: 有
U2 = IS62WV51216BLL-55TLI: 8-Mbit(512K × 16bit)，并行接口，工作电压：2.5V to 3.6V; Manufacturer: ISSI(美国芯成); Add into BOM: yes; Symbol: IS62WV51216BLL-55TLI; Device: IS62WV51216BLL-55TLI; Supplier: LCSC; Manufacturer Part: IS62WV51216BLL-55TLI; Supplier Part: C11315; LCSC Part Name: IS62WV51216BLL-55TLI; Supplier Footprint: TSOP-44-10.2mm; Datasheet: https://atta.szlcsc.com/upload/public/pdf/source/20130225/1457706593006.pdf; Convert to PCB: yes
U3 = W25Q128JVSIQ_C113767: 接口类型:SPI;存储容量:128Mbit;; Manufacturer: WINBOND(华邦); Symbol: W25Q128JVSIQTR; Add into BOM: yes; Interface Type: SPI; Supply Voltage: 2.7V~3.6V; Page Programming Time (Tpp): 3ms; Device: W25Q128JVSIQ_C113767; LCSC Part Name: W25Q128JVSIQ; Supplier Part: C113767; Manufacturer Part: W25Q128JVSIQ; Supplier Footprint: SOIC-8-208mil; JLCPCB Part Class: Extended Part; Datasheet: https://atta.szlcsc.com/upload/public/pdf/source/20180329/C113767_097B64D788F6E3FFB2E9CB46CB6C1427.pdf; Supplier: LCSC; Convert to PCB: yes; Memory Size: 128Mbit; Operating Temperature: -40℃~+85℃; Clock Frequency (fc): -; Supply Current (Read): -; Supply Current (Program): -; Supply Current (Erase): -; Standby supply current: -; Block Erase Time (tBE): -; Data Retention - TDR (Year): -
Y1 = X308032768KGB2SC: 晶振类型:直插晶振;频率:32.768kHz;常温频差:±10ppm;外接负载电容:12.5pF;频率稳定度(全温):-;; Manufacturer: YXC(扬兴晶振); Add into BOM: yes; Crystal Type: 直插晶振; Normal temperature Frequency Tolerance: ±10ppm; External load capacitor: 12.5pF; Symbol: X308032768KGB2SC; Device: X308032768KGB2SC; LCSC Part Name: 32.768kHz ±10ppm 12.5pF YT-38; Supplier Part: C52082; Manufacturer Part: X308032768KGB2SC; Supplier Footprint: DT-38; Datasheet: https://atta.szlcsc.com/upload/public/pdf/source/20240329/231E1A1EB7C875CD193DBE6664A3DE3A.pdf; Supplier: LCSC; Convert to PCB: yes; Value: 32.768kHz; Frequency Stability(Full temperature range): -; Operating Temperature: -20℃~+70℃
Y2 = TAXD12M2GLFBET2T: 晶振类型:直插晶振;频率:12MHz;常温频差:±30ppm;外接负载电容:20pF;频率稳定度(全温):±30ppm;; Manufacturer: YJX(雅晶鑫); Symbol: X308032768KGB2SC; Add into BOM: yes; Crystal Type: 直插晶振; Normal temperature Frequency Tolerance: ±30ppm; External load capacitor: 20pF; Equivalent Series Resistance (ESR): 50Ω; Device: TAXD12M2GLFBET2T; LCSC Part Name: 12MHz ±30ppm 20pF; Supplier Part: C127674; Manufacturer Part: TAXD12M2GLFBET2T; Supplier Footprint: HC-49S; JLCPCB Part Class: Extended Part; Datasheet: https://atta.szlcsc.com/upload/public/pdf/source/20170914/C127676_1505359415156967690.pdf; Supplier: LCSC; Convert to PCB: yes; Value: 12MHz; Frequency Stability(Full temperature range): ±30ppm; Operating Temperature: -20℃~+70℃